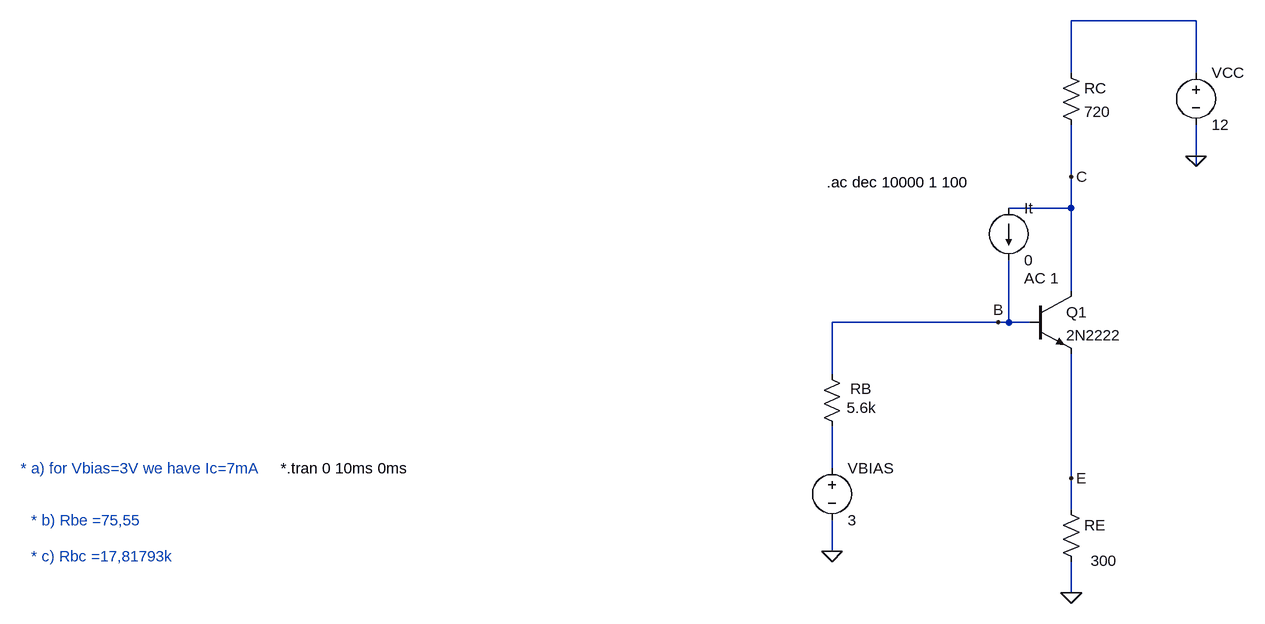
[diagram p0: schematic ask1.asc]
ask1.asc, the LTspice schematic file:
Version 4
SHEET 1 1144 680
WIRE 1072 -464 880 -464
WIRE 880 -384 880 -464
WIRE 1072 -384 1072 -464
WIRE 1072 -256 1072 -304
WIRE 1072 -240 1072 -256
WIRE 880 -224 880 -304
WIRE 880 -176 880 -224
WIRE 880 -176 784 -176
WIRE 880 -48 880 -176
WIRE 768 0 512 0
WIRE 784 0 784 -96
WIRE 784 0 768 0
WIRE 816 0 784 0
WIRE 512 80 512 0
WIRE 512 224 512 160
WIRE 880 240 880 48
WIRE 880 288 880 240
WIRE 512 352 512 304
WIRE 880 416 880 368
FLAG 880 416 0
FLAG 512 352 0
FLAG 1072 -256 0
FLAG 768 0 B
FLAG 880 240 E
FLAG 880 -224 C
SYMBOL res 496 64 R0
WINDOW 0 44 38 Left 2
WINDOW 3 39 67 Left 2
SYMATTR InstName RB
SYMATTR Value 5.6k
SYMBOL npn 816 -48 R0
SYMATTR InstName Q1
SYMATTR Value 2N2222
SYMBOL res 864 272 R0
WINDOW 3 46 95 Left 2
SYMATTR Value 300
SYMATTR InstName RE
SYMBOL res 864 -400 R0
SYMATTR InstName RC
SYMATTR Value 720
SYMBOL voltage 512 208 R0
SYMATTR InstName VBIAS
SYMATTR Value 3
SYMBOL voltage 1072 -400 R0
SYMATTR InstName VCC
SYMATTR Value 12
SYMBOL current 784 -176 R0
WINDOW 123 24 108 Left 2
WINDOW 39 0 0 Left 0
SYMATTR Value2 AC 1
SYMATTR InstName It
SYMATTR Value 0
TEXT -336 224 Left 2 !*.tran 0 10ms 0ms
TEXT 504 -216 Left 2 !.ac dec 10000 1 100
TEXT -736 224 Left 2 ;* a) for Vbias=3V we have Ic=7mA
TEXT -720 304 Left 2 ;* b) Rbe =75,55
TEXT -720 360 Left 2 ;* c) Rbc =17,81793k

The netlist it stands for:
* ask1.asc
RB B N002 5.6k
Q1 C B E 0 2N2222
RE E 0 300
RC N001 C 720
VBIAS N002 0 3
VCC N001 0 12
It C B 0 AC 1
.model NPN NPN
.model PNP PNP
.lib standard.bjt
*.tran 0 10ms 0ms
.ac dec 10000 1 100
* * a) for Vbias=3V we have Ic=7mA
* * b) Rbe =75,55
* * c) Rbc =17,81793k
.backanno
.end